# EAGLE schematic Generic MOSFET LVD (EAGLE 7.1.0)
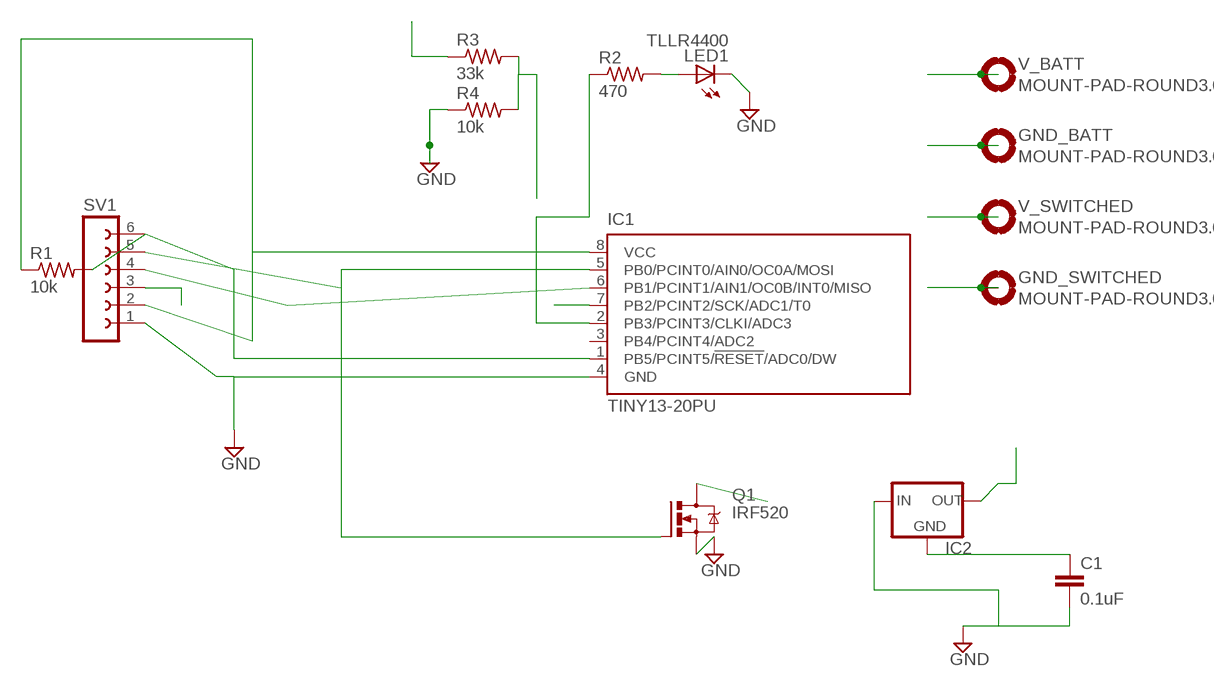
[diagram p0: schematic, sheet 1]

## Parts
C1  0.1uF  C2,5-3  [C2.5-3]
GND_BATT  MOUNT-PAD-ROUND3.0  [3,0-PAD]
GND_SWITCHED  MOUNT-PAD-ROUND3.0  [3,0-PAD]
IC1  TINY13-20PU  [DIL08]
IC2  78XXS  [78XXS]
LED1  TLLR4400  [LED3MM]
Q1  IRF520  [TO220BV]
R1  10k  R-US_0204/5  [0204/5]
R2  470  R-US_0204/5  [0204/5]
R3  33k  R-US_0204/5  [0204/5]
R4  10k  R-US_0204/5  [0204/5]
SV1  FE06-1  [FE06]
V_BATT  MOUNT-PAD-ROUND3.0  [3,0-PAD]
V_SWITCHED  MOUNT-PAD-ROUND3.0  [3,0-PAD]

## Nets
GND: C1.2 GND_BATT.B3,0(MOUNT) IC1.4(GND) IC2.IN LED1.K(C) Q1.S R4.1 SV1.1
GND_SWITCHED: GND_SWITCHED.B3,0(MOUNT) Q1.D
LED_SIGNAL: IC1.2(PB3/PCINT3/CLKI/ADC3) R2.1
N$1: IC1.1(PB5/PCINT5/!RESET!/ADC0/DW) R1.2 SV1.6
N$4: LED1.A R2.2
N$5: IC1.5(PB0/PCINT0/AIN0/OC0A/MOSI) Q1.G SV1.5
N$6: IC1.6(PB1/PCINT1/AIN1/OC0B/INT0/MISO) SV1.4
V_BATT: IC2.OUT R3.1 V_BATT.B3,0(MOUNT) V_SWITCHED.B3,0(MOUNT)
V_SENSE: IC1.7(PB2/PCINT2/SCK/ADC1/T0) R3.2 R4.2 SV1.3
VCC: C1.1 IC1.8(VCC) IC2.GND R1.1 SV1.2
Unconnected: IC1.3(PB4/PCINT4/ADC2)

## Library data of the parts
C1 = capacitor-wima:C: CAPACITOR naming: grid - package width
GND_BATT GND_SWITCHED V_BATT V_SWITCHED = holes:MOUNT-PAD-ROUND: MOUNTING PAD, round
IC1 = atmel:TINY13: 8-bit AVR Microcontroller with 1K Bytes In-System Programmable Flash Source: http://www.atmel.com/dyn/resources/prod_documents/2535S.pdf; MPN: ATTINY13-20PU; OC_FARNELL: 9171550; OC_NEWARK: 96K6521
IC2 = v-reg:78XXS: VOLTAGE REGULATOR
LED1 = led:TLLR4400: Low Current (2mA) LED 3 mm Tinted Diffused Package color RED Source: Data sheet <http://www.farnell.com/datasheets/391100.pdf>; MF: VISHAY SEMICONDUCTOR; OC_FARNELL: 1612437
Q1 = transistor-power:IRF520: HEXFET Power MOSFET
R1-R4 = resistor:R-US_: RESISTOR, American symbol
SV1 = con-lsta:FE06-1: FEMALE HEADER; OC_FARNELL: unknown; OC_NEWARK: unknown